# Altium schematic sheet Modules.SchDoc
size A
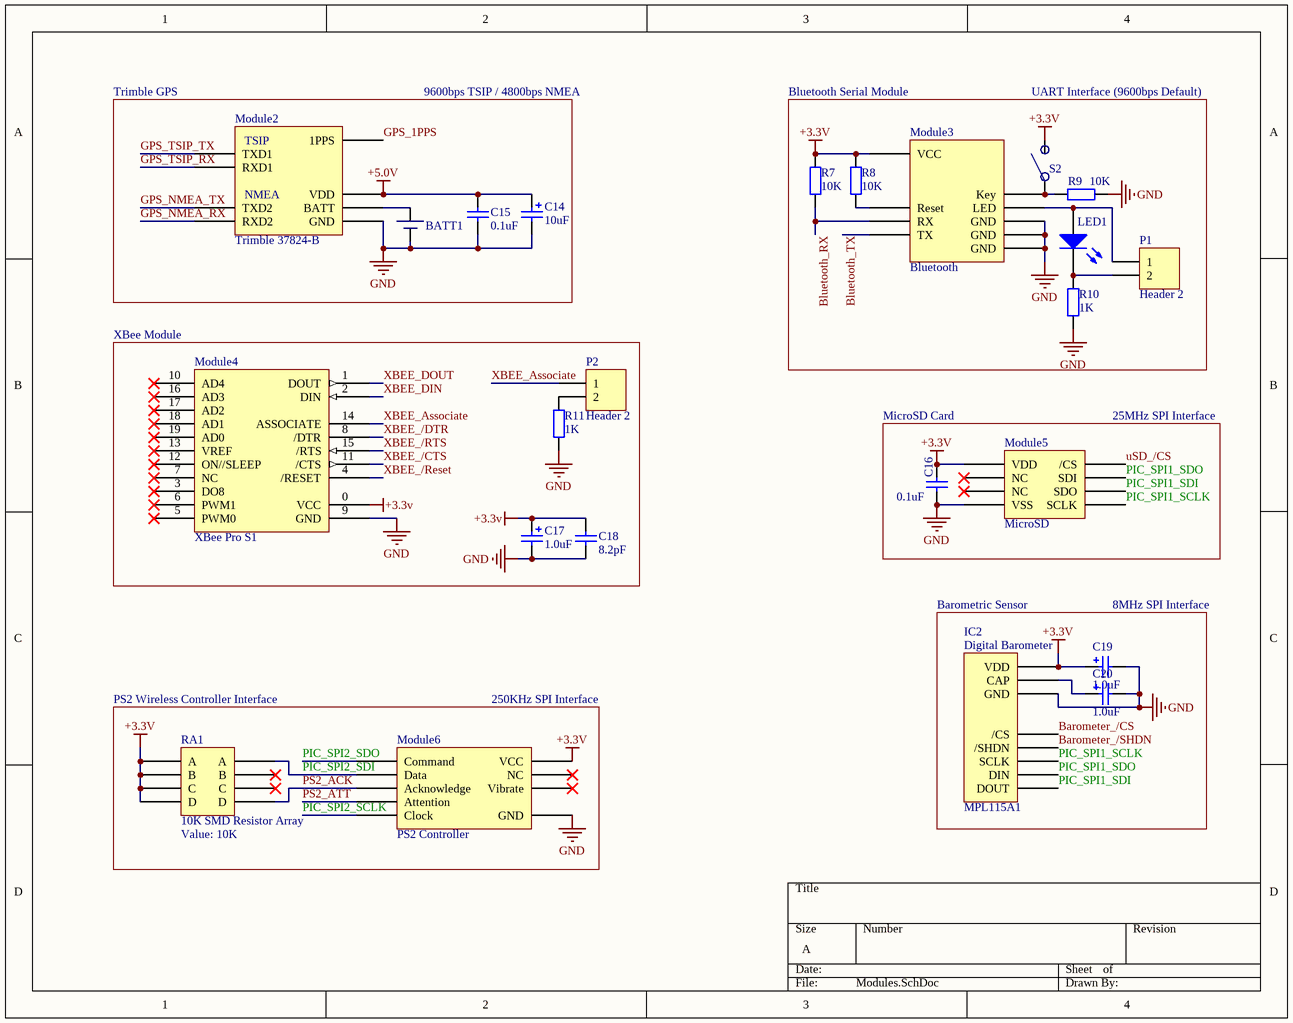
[diagram p0: Modules.SchDoc]

## Parts
BATT1  Coin Cell Holder  [Coil Cell Holder]  (value not drawn)
C14  value 10uF  [Capacitor - Tantalum Case A]  (hidden comment: 10uF Low-ESR Tantalum CaseA)
C15  value 0.1uF  [SMD 1206]  (hidden comment: 0.1uF SMD 1206)
C16  value 0.1uF  [SMD 1206]  (hidden comment: 0.1uF SMD 1206)
C17  value 1.0uF  [Capacitor - Tantalum Case A]  (hidden comment: 1.0uF Low-ESR Tantalum CaseA)
C18  value 8.2pF  [SMD 0805]  (hidden comment: 8.2pF SMD 0805)
C19  value 1.0uF  [Capacitor - Tantalum Case A]  (hidden comment: 1.0uF Low-ESR Tantalum CaseA)
C20  value 1.0uF  [Capacitor - Tantalum Case A]  (hidden comment: 1.0uF Low-ESR Tantalum CaseA)
IC2  MPL115A1  [MPL115A1]
LED1  Link  [PLCC-4 LED]  (value not drawn)
Module2  Trimble 37824-B  [Trimble 37824-B]
Module3  Bluetooth  [BT0417C Bluetooth Module]
Module4  XBee Pro S1  [XBee Pro S1 Wireless Module]
Module5  MicroSD  [MicroSD Card Slot]
Module6  PS2 Controller  [PS2 Wireless Module]
P1  Header 2  [HDR1X2]
P2  Header 2  [HDR1X2]
R7  value 10K  [SMD 0805]  (hidden comment: 10K SMD 0805)
R8  value 10K  [SMD 0805]  (hidden comment: 10K SMD 0805)
R9  value 10K  [SMD 0805]  (hidden comment: 10K SMD 0805)
R10  value 1K  [SMD 0805]  (hidden comment: 1K SMD 0805)
R11  value 1K  [SMD 0805]  (hidden comment: 1K SMD 0805)
RA1  10K SMD Resistor Array  value 10K  [Resistor Array YC164]
S2  Key  [SMD Tactile Switch]  (value not drawn)

## Blocks framed on the sheet
XBee Module: C17 C18 Module4 P2 R11

## Nets
+3.3V: C16.2 C17.1(+) C18.2 C19.1(+) IC2.0(VDD) Module3.4(VCC) Module4.0(VCC) Module5.3(VDD) Module6.5(VCC) R7.2 R8.1 RA1.5(A) RA1.6(B) RA1.7(C) RA1.8(D) S2.1
+5.0V: C14.1(+) C15.1 Module2.2(VDD)
GND: BATT1.NEG C14.2(-) C15.2 C16.1 C17.2(-) C18.1 C19.2(-) C20.2(-) IC2.2(GND) Module2.8(GND) Module3.5(GND) Module3.6(GND) Module3.7(GND) Module4.9(GND) Module5.5(VSS) Module6.4(GND) R9.1 R10.2 R11.2
Barometer_/CS: IC2.4(/CS)
Barometer_/SHDN: IC2.3(/SHDN)
Bluetooth_RX: Module3.2(RX) R7.1
Bluetooth_TX: Module3.1(TX)
GPS_1PPS: Module2.6(1PPS)
GPS_NMEA_RX: Module2.7(RXD2)
GPS_NMEA_TX: Module2.1(TXD2)
GPS_TSIP_RX: Module2.5(RXD1)
GPS_TSIP_TX: Module2.3(TXD1)
PIC_SPI1_SCLK: IC2.7(SCLK) Module5.4(SCLK)
PIC_SPI1_SDI: IC2.5(DOUT) Module5.6(SDO)
PIC_SPI1_SDO: IC2.6(DIN) Module5.2(SDI)
PIC_SPI2_SCLK: Module6.7(Clock)
PIC_SPI2_SDI: Module6.1(Data) RA1.1(A)
PIC_SPI2_SDO: Module6.2(Command)
PS2_ACK: Module6.9(Acknowledge) RA1.4(D)
PS2_ATT: Module6.6(Attention)
uSD_/CS: Module5.1(/CS)
XBEE_/CTS: Module4.11(/CTS)
XBEE_/DTR: Module4.8(/DTR)
XBEE_/Reset: Module4.4(/RESET)
XBEE_/RTS: Module4.15(/RTS)
XBEE_Associate: Module4.14(ASSOCIATE) P2.1
XBEE_DIN: Module4.2(DIN)
XBEE_DOUT: Module4.1(DOUT)
NetBATT1_POS: BATT1.POS Module2.4(BATT)
NetC20_1: C20.1(+) IC2.1(CAP)
NetLED1_1: LED1.1(A) Module3.8(LED) P1.1
NetLED1_2: LED1.2(K) P1.2 R10.1
NetModule3_3: Module3.3(Reset) R8.2
NetModule3_9: Module3.9(Key) R9.2 S2.2
NetP2_2: P2.2 R11.1

Not connected (* = marked no-connect by the designer): Module4 3(DO8)* 5(PWM0)* 6(PWM1)* 7(NC)* 10(AD4)* 12(ON//SLEEP)* 13(VREF)* 16(AD3)* 17(AD2)* 18(AD1)* 19(AD0)*; Module5 0(NC)* 7(NC)*; Module6 3(Vibrate)* 8(NC)*; RA1 2(B)* 3(C)*

## Notes on the sheet
- Trimble GPS
- 9600bps TSIP / 4800bps NMEA
- Bluetooth Serial Module
- UART Interface (9600bps Default)
- MicroSD Card
- (near Module5) 25MHz SPI Interface
- Barometric Sensor
- 8MHz SPI Interface
- PS2 Wireless Controller Interface
- 250KHz SPI Interface
- (in symbol MPL115A1) Digital Barometer
- (in symbol Trimble 37824-B) TSIP; NMEA

## Library data of the parts
BATT1 = Coin Cell Holder: Coin Cell Battery Holder
C14 C17 C19 C20 = SMD_Cap_Tantalum: Tantalum Capacitor - Case A
C15 C16 C18 = Cap: Capacitor
IC2 = MPL115A1: Miniature SPI Digital Barometer; pin to pad: 0>1 1>2 2>3 3>4 4>5 5>6 6>7 7>8
LED1 = SMD LED: pin to pad: 1>2 2>1
Module2 = Trimble 37824-B: Trimble 37824-B GPS Module
Module3 = Bluetooth SMD Module: Bluetooth SMD Serial Module; pin to pad: 3>11 4>12 5>13 6>21 7>22 8>24 9>26
Module4 = XBee Pro S1: XBee Pro S1 60mW Wireless Module; pin to pad: 0>1 1>2 2>3 3>4 4>5 5>6 6>7 7>8 8>9 9>10 10>11 11>12 12>13 13>14 14>15 15>16 16>17 17>18 18>19 19>20
Module5 = MicroSD Socket: MicroSD SPI Interface; pin to pad: 0>1 1>2 2>3 3>4 4>5 5>6 6>7 7>8; Supplier 1: Digi-Key
Module6 = PS2 Wireless Controller
P1 P2 = Header 2: Header, 2-Pin; LatestRevisionDate: 17-Jul-2002; LatestRevisionNote: Re-released for DXP Platform.; Publisher: Altium Limited
R7-R11 = Res2: Resistor
RA1 = SMD Resistor Array: 4-Count Resistor Array; pin to pad: 5>8 6>7 7>6 8>5
S2 = SMD Tactile Switch